# EAGLE design POWER-12V5V (EAGLE 9.4.0)
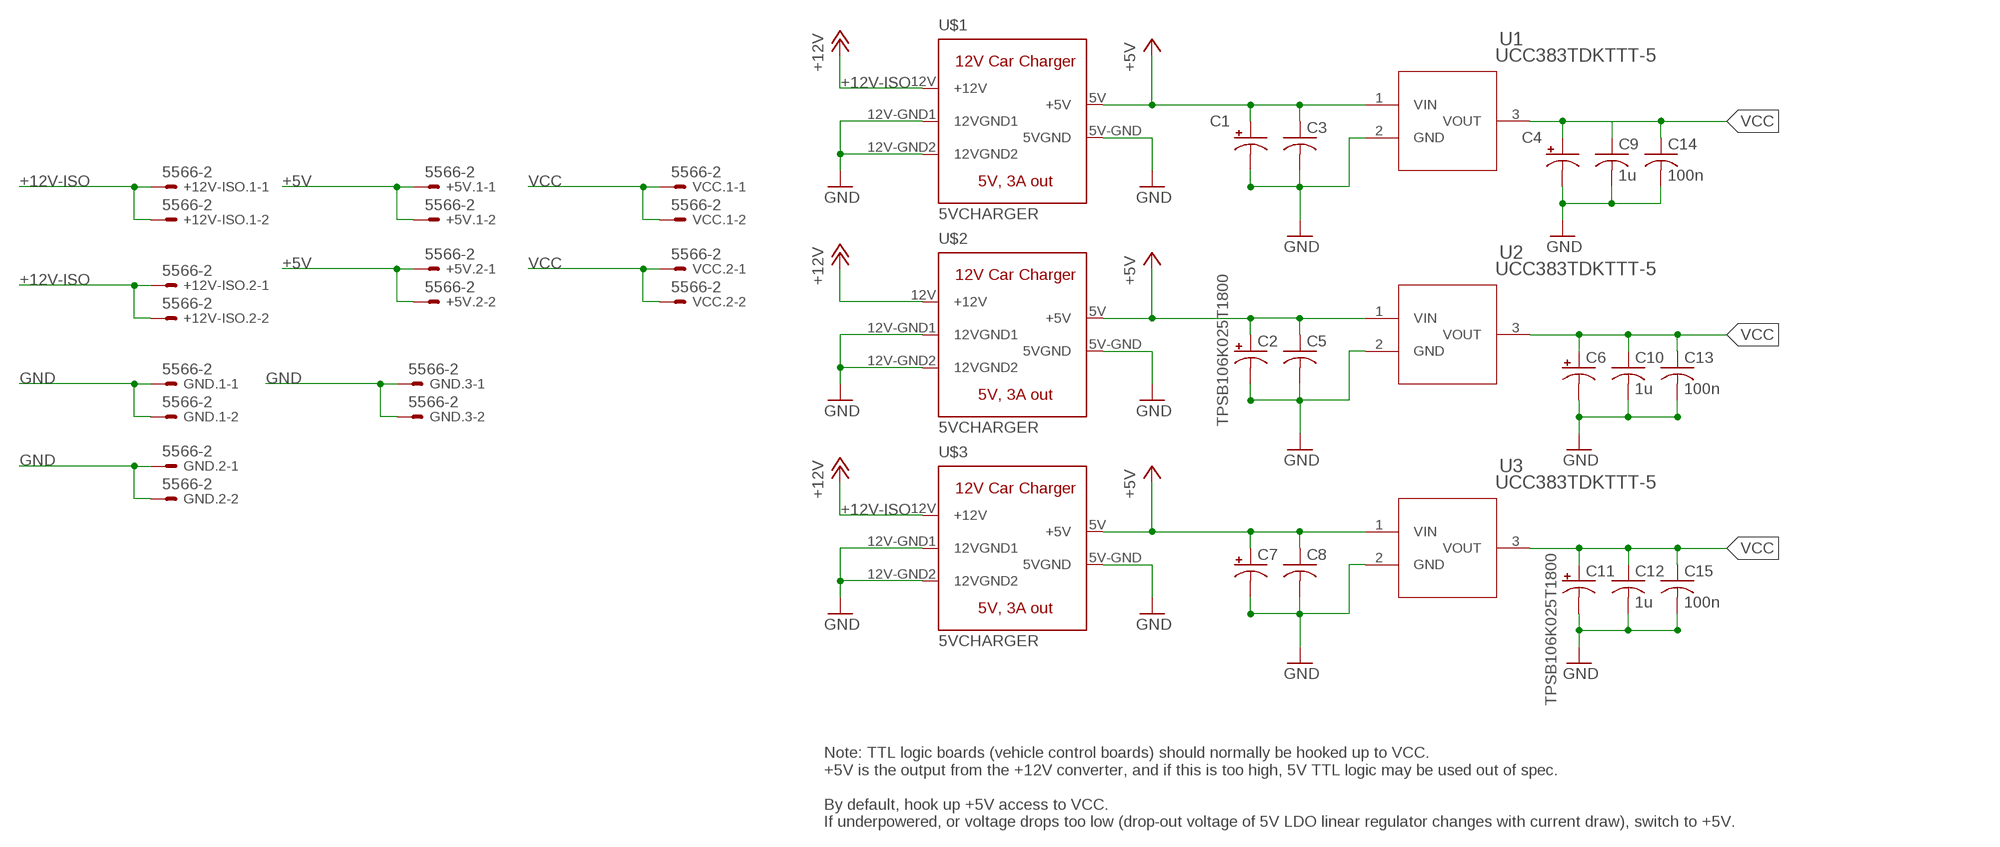
[diagram p0: schematic, sheet 1]

## Parts
+5V.1  5566-2  [5566-2]
+5V.2  5566-2  [5566-2]
+12V-ISO.1  5566-2  [5566-2]
+12V-ISO.2  5566-2  [5566-2]
C1  TPSB106K025T1800  [DIONM3528X210N]
C2  TPSB106K025T1800  [DIONM3528X210N]
C3  C-USC0805  [C0805]
C4  TPSB106K025T1800  [DIONM3528X210N]
C5  C-USC0805  [C0805]
C6  TPSB106K025T1800  [DIONM3528X210N]
C7  TPSB106K025T1800  [DIONM3528X210N]
C8  C-USC0805  [C0805]
C9  1u  C-USC0805  [C0805]
C10  1u  C-USC0805  [C0805]
C11  TPSB106K025T1800  [DIONM3528X210N]
C12  1u  C-USC0805  [C0805]
C13  100n  C-USC0805  [C0805]
C14  100n  C-USC0805  [C0805]
C15  100n  C-USC0805  [C0805]
GND.1  5566-2  [5566-2]
GND.2  5566-2  [5566-2]
GND.3  5566-2  [5566-2]
U1  UCC383TDKTTT-5  [TO263-3]
U2  UCC383TDKTTT-5  [TO263-3]
U3  UCC383TDKTTT-5  [TO263-3]
U$1  5VCHARGER  [5VCHARGER]
U$2  5VCHARGER  [5VCHARGER]
U$3  5VCHARGER  [5VCHARGER]
VCC.1  5566-2  [5566-2]
VCC.2  5566-2  [5566-2]

## Nets
+5V: +5V.1.1 +5V.1.2 +5V.2.1 +5V.2.2 C1.1(+) C2.1(+) C3.1 C5.1 C7.1(+) C8.1 U1.1(VIN) U2.1(VIN) U3.1(VIN) U$1.5V(+5V) U$2.5V(+5V) U$3.5V(+5V)
+12V-ISO: +12V-ISO.1.1 +12V-ISO.1.2 +12V-ISO.2.1 +12V-ISO.2.2 U$1.12V(+12V) U$2.12V(+12V) U$3.12V(+12V) ; supply symbol labelled +12V
GND: C1.2(-) C2.2(-) C3.2 C4.2(-) C5.2 C6.2(-) C7.2(-) C8.2 C9.2 C10.2 C11.2(-) C12.2 C13.2 C14.2 C15.2 GND.1.1 GND.1.2 GND.2.1 GND.2.2 GND.3.1 GND.3.2 U1.2(GND) U2.2(GND) U3.2(GND) U$1.5V-GND(5VGND) U$1.12V-GND1(12VGND1) U$1.12V-GND2(12VGND2) U$2.5V-GND(5VGND) U$2.12V-GND1(12VGND1) U$2.12V-GND2(12VGND2) U$3.5V-GND(5VGND) U$3.12V-GND1(12VGND1) U$3.12V-GND2(12VGND2)
VCC: C4.1(+) C6.1(+) C9.1 C10.1 C11.1(+) C12.1 C13.1 C14.1 C15.1 U1.3(VOUT) U2.3(VOUT) U3.3(VOUT) VCC.1.1 VCC.1.2 VCC.2.1 VCC.2.2

## Notes on the sheet
- Note: TTL logic boards (vehicle control boards) should normally be hooked up to VCC.
  +5V is the output from the +12V converter, and if this is too high, 5V TTL logic may be used out of spec.
  
  By default, hook up +5V access to VCC.
  If underpowered, or voltage drops too low (drop-out voltage of 5V LDO linear regulator changes with current draw), switch to +5V.

## Library data of the parts
+5V.1 +5V.2 +12V-ISO.1 +12V-ISO.2 GND.1-GND.3 VCC.1 VCC.2 = con-molex:5566-2: Mini FIT connector 2 pol Source: http://www.molex.com; MF: MOLEX; OC_FARNELL: 1822072; OC_NEWARK: unknown
C1 C2 C4 C6 C7 C11 = TPSB106K025T1800:TPSB106K025T1800: Tantalum Capacitors - Solid SMD 25V 10uF 10% ESR=1800Ohm AEC-Q200 Source: Datasheet <https://componentsearchengine.com/Datasheets/1/TPSB106K025T1800.pdf>; DESCRIPTION: Tantalum Capacitors - Solid SMD 25V 10uF 10% ESR=1800Ohm AEC-Q200; HEIGHT: 2.1mm; MANUFACTURER_NAME: AVX; MANUFACTURER_PART_NUMBER: TPSB106K025T1800; MOUSER_PART_NUMBER: 581-TPSB106K025T1800; MOUSER_PRICE-STOCK: https://www.mouser.com/Search/Refine.aspx?Keyword=581-TPSB106K025T1800
C3 C5 C8-C10 C12-C15 = rcl:C-US: CAPACITOR, American symbol; SPICEPREFIX: C
U1-U3 = IowaFormula:UCC383TDKTTT-5
U$1-U$3 = IowaFormula:5VCHARGER

## Board
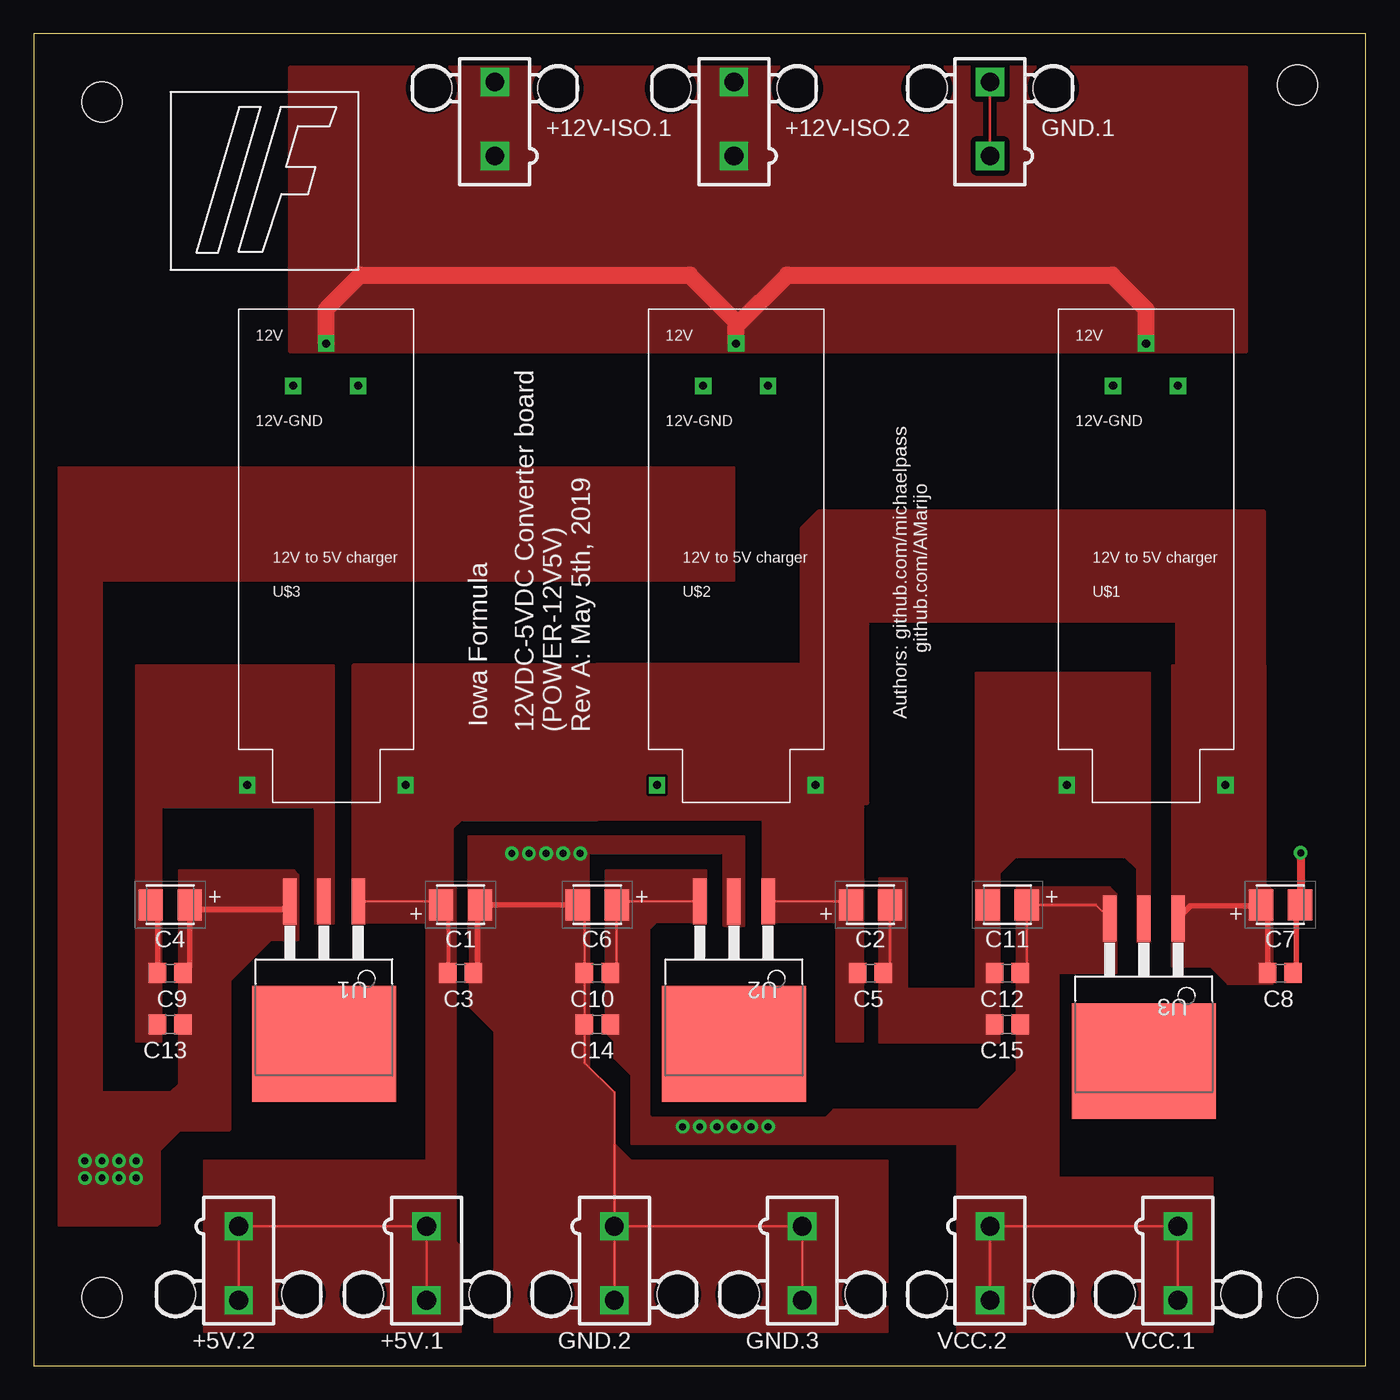
[diagram p1: board, top side]
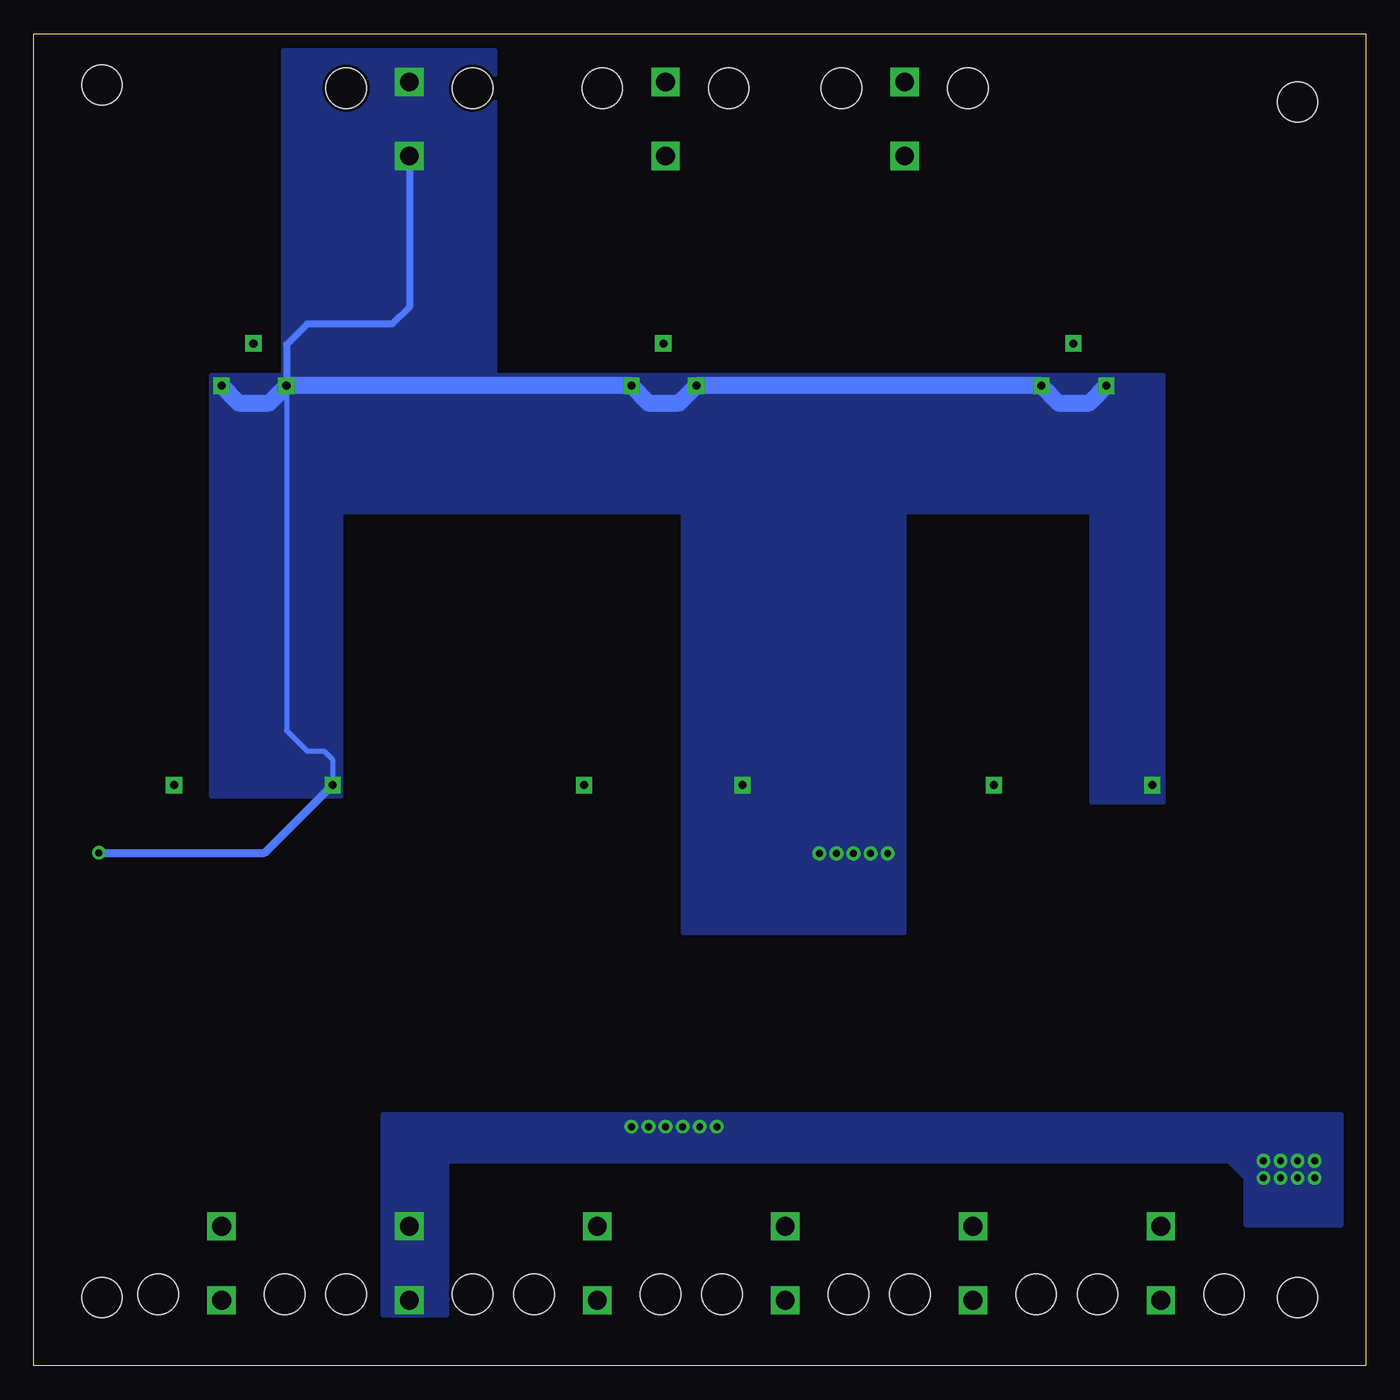
[diagram p2: board, bottom side, seen from below]

Size 99.06 x 99.06 mm. Coordinates in mm from the lower left corner, seen from the top.
Outline: 0,0 99.06,0 99.06,99.06 0,99.06 0,0
Copper layers (1*16): Top 0.035mm / dielectric 1.5mm / Bottom 0.035mm
Design rules "default *": minimum track width 8mil, minimum drill 20mil, track to track 8mil, track to pad 8mil, pad to pad 8mil, via to via 8mil, smd to smd 8mil, copper to edge 10mil, drill to drill 8mil, minimum pad ring 12mil, minimum via ring 10mil, stop-mask expansion 4mil, vias tented up to drill 25mil, thermal gap 10mil
Holes 3 mm at 5.08,5.08 5.08,93.98 93.98,95.25 93.98,5.08

### Footprints (pad centres in the part's own frame; a part is rotated, then mirrored left to right if it is on the bottom)
5566-2 = drill 1.4 square: 1 0,-2.75; 2 0,2.75 | hole 3: 4.7,2.29; -4.7,2.29
DIONM3528X210N = smd 1.8 x 2.3: 1 -1.45,0; 2 1.45,0
C0805 = smd 1.3 x 1.5: 1 -0.95,0; 2 0.95,0
TO263-3 = smd 1 x 3.4: 1 -2.54,-6.6; 2 0,-6.6; 3 2.54,-6.6 | smd 10.7 x 8.6: TAB 0,4
5VCHARGER = drill 0.6 square: 5V 12.421,1.27; 5V-GND 0.635,1.27; 12V 6.515,34.112; 12V-GND1 4.064,30.963; 12V-GND2 8.89,30.963

### Placement (x,y rotation side)
+5V.1  29.21,7.62 180 top
+5V.2  15.24,7.62 180 top
+12V-ISO.1  34.29,92.71 0 top
+12V-ISO.2  52.07,92.71 0 top
C1  31.75,34.29 0 top
C2  62.23,34.29 0 top
C3  31.75,29.21 0 top
C4  10.16,34.29 180 top
C5  62.23,29.21 0 top
C6  41.91,34.29 180 top
C7  92.71,34.29 0 top
C8  92.71,29.21 0 top
C9  10.16,29.21 180 top
C10  41.91,29.21 180 top
C11  72.39,34.29 180 top
C12  72.39,29.21 180 top
C13  10.16,25.4 180 top
C14  41.91,25.4 180 top
C15  72.39,25.4 180 top
GND.1  71.12,92.71 0 top
GND.2  43.18,7.62 180 top
GND.3  57.15,7.62 180 top
U1  21.59,27.94 180 top
U2  52.07,27.94 180 top
U3  82.55,26.67 180 top
U$1  76.2,41.91 0 top
U$2  45.72,41.91 0 top
U$3  15.24,41.91 0 top
VCC.1  85.09,7.62 180 top
VCC.2  71.12,7.62 180 top

### Tracks (layer width: path | path; a pad name or v marks a point on that pad's centre or on a via)
+5V
  Top 0.203: 30.8,33.79 C1.1 30.05,34.54 U1.1 | C7.1 91.35,34.2 91.76,33.79 | +5V.2.2 +5V.2.1 +5V.1.1 +5V.1.2 | U2.1 60.53,34.54 C2.1
  Top 0.305: 30.8,33.79 C3.1
  Top 0.406: 91.76,33.79 C8.1 | 91.35,34.2 86.02,34.2 U3.1
  pour Top (isolate 0.406, no thermals): 23.8,33.02 23.8,52.1 41.91,52.1 41.91,40.64 31.75,40.64 31.09,39.98 31.09,32.87 30.94,33.02
  pour Top (no thermals): 31.37,35.56 31.37,9.27 31.75,8.89 31.75,2.54 12.7,2.54 12.7,15.24 29.21,15.24 29.21,35.56
  pour Top (no thermals): 41.91,52.22 41.91,40.64 54.23,40.64 54.23,33.02 59.69,33.02 59.69,24.13 61.67,24.13 61.67,52.2 41.94,52.2
  pour Top (no thermals): 84.66,29.69 84.66,52.07 91.59,52.07 91.59,35.89 92.1,35.38 92.1,28.4 88.8,28.4 87.5,29.69
  pour Top: 57.15,41.91 57.15,62.23 58.42,63.5 91.44,63.5 91.44,50.8 90.17,49.53 85.09,49.53 85.09,55.47 61.93,55.47 61.93,41.91
+12V-ISO
  Top 1.27: 52.23,77.29 56.05,81.1 80.17,81.1 82.72,78.56 U$1.12V | U$2.12V 52.23,77.29 | U$3.12V 21.75,78.56 24.3,81.1 48.78,81.1 52.23,77.65 52.23,77.29
  pour Top (isolate 0.406, no thermals): 19.05,75.46 90.17,75.46 90.17,96.52 19.05,96.52
GND  (via drill 0.51)
  Top 0.203: C4.2 9.21,33.79 | C6.2 40.96,33.79 C10.2 40.96,22.54 43.18,20.32 GND.2.1 | GND.2.1 GND.3.1 GND.3.2 | GND.2.1 GND.2.2 | C2.2 63.68,29.71 C5.2 | GND.1.2 GND.1.1
  Top 0.305: 33.02,29.53 C3.2
  Top 0.406: 9.21,33.79 C9.2 | C6.2 C1.2 33.02,34.11 33.02,29.53 | C7.2 94.07,34.2 93.88,34.01 93.88,29.81 93.66,29.59 C8.2
  Top 0.61: v94.21,38.15 94.21,34.34 94.07,34.2
  Bottom 0.381: U$1.12V-GND1 80.26,47.24 78.74,45.72 77.47,45.72 76.83,45.09 U$1.5V-GND
  Bottom 0.508: GND.1.1 71.12,78.74 72.39,77.47 78.74,77.47 80.26,75.95 U$1.12V-GND1
  Bottom 0.61: v94.21,38.15 81.86,38.15 U$1.5V-GND
  Bottom 1.27: U$3.12V-GND1 20.57,71.6 22.86,71.6 U$3.12V-GND2 U$2.12V-GND1 51.05,71.6 53.34,71.6 U$2.12V-GND2 U$1.12V-GND1 81.53,71.6 83.82,71.6 U$1.12V-GND2
  other vias: 35.56,38.1 36.83,38.1 38.1,38.1 39.37,38.1 40.64,38.1
  pour Bottom (no thermals): 15.01,41.91 15.01,73.66 85.88,73.66 85.88,42.34 76.15,42.34 76.15,63.5 50.8,63.5 50.8,32.21 34.29,32.21 34.29,63.5 20.45,63.5 20.45,41.91
  pour Top (no thermals): 9.47,24.13 7.62,24.13 7.62,52.07 22.3,52.07 22.3,32.89 20.95,32.89 20.93,32.87 20.93,41.43 20.8,41.55 9.47,41.55
  pour Top (no thermals): 32.44,35.56 41.2,35.56 41.3,35.66 41.3,22.2 43.18,20.32 43.18,16.51 44.45,15.24 63.5,15.24 63.5,2.54 34.29,2.54 34.29,24.82 32.44,26.67
  pour Top (no thermals): 82.07,31.52 82.98,31.52 82.98,51.51 70.08,51.51 70.08,28.02 64.92,28.02 64.92,36.25 62.89,36.25 62.89,24.05 71.81,24.05 71.81,36.6 73.05,37.85 81.15,37.85 82.07,36.93
  pour Top (no thermals): 32.36,31.83 32.36,39.37 52.81,39.37 52.81,32.72 51.36,32.72 51.31,32.77 51.31,38.15 41.27,38.15 41.25,38.13 41.25,31.42 41.3,31.37 32.82,31.37
  pour Bottom (no thermals): 64.77,72.39 64.77,97.79 80.47,97.79 80.47,72.39
VCC  (via drill 0.51)
  Top 0.203: VCC.2.2 VCC.2.1 VCC.1.1 VCC.1.2 | 11.61,29.71 C9.1 | 12.09,33.96 11.75,34.29 C4.1 | C10.1 43.36,29.71 C6.1 43.61,34.54 U2.3 | C12.1 73.84,29.71 C11.1 78.99,34.29 U3.3
  Top 0.406: C4.1 11.61,29.71 | 12.09,33.96 18.47,33.96 U1.3
  other vias: 48.26,17.78 49.53,17.78 50.8,17.78 52.07,17.78 53.34,17.78 54.61,17.78 3.81,15.24 5.08,15.24 6.35,15.24 7.62,15.24 3.81,13.97 5.08,13.97 6.35,13.97 7.62,13.97
  pour Top (no thermals): 68.68,2.54 87.63,2.54 87.63,13.97 76.2,13.97 76.2,29.21 80.49,29.21 80.49,35.08 80.01,35.56 73.1,35.56 73.1,21.92 68.68,17.5
  pour Top (no thermals): 10.82,36.83 19.35,36.83 19.68,36.5 19.68,31.67 17.65,31.67 14.61,28.63 14.61,17.6 14.53,17.53 10.9,17.53 9.37,16 9.37,10.62 9.19,10.44 1.88,10.44 1.88,66.8 52.07,66.8 52.07,58.39 5.08,58.39 5.08,20.32 10.16,20.32 10.82,20.98
  pour Top (no thermals): 49.99,33.02 49.99,36.83 42.57,36.83 42.55,36.86 42.55,24.77 43.18,24.13 43.18,22.86 44.45,21.59 44.45,16.51 73.66,16.51 73.66,19.05 59.49,19.05 58.88,18.44 45.97,18.44 45.75,18.67 45.75,32.46 46.3,33.02
  pour Bottom (no thermals): 1.88,18.67 73.08,18.67 73.08,3.81 68.35,3.81 68.35,15.24 10.16,15.24 8.89,13.97 8.89,10.49 1.88,10.49

### Text on the board
tNames: Iowa Formula | Authors: github.com/michaelpass / github.com/AMarijo | 12VDC-5VDC Converter board / (POWER-12V5V) / Rev A: May 5th, 2019